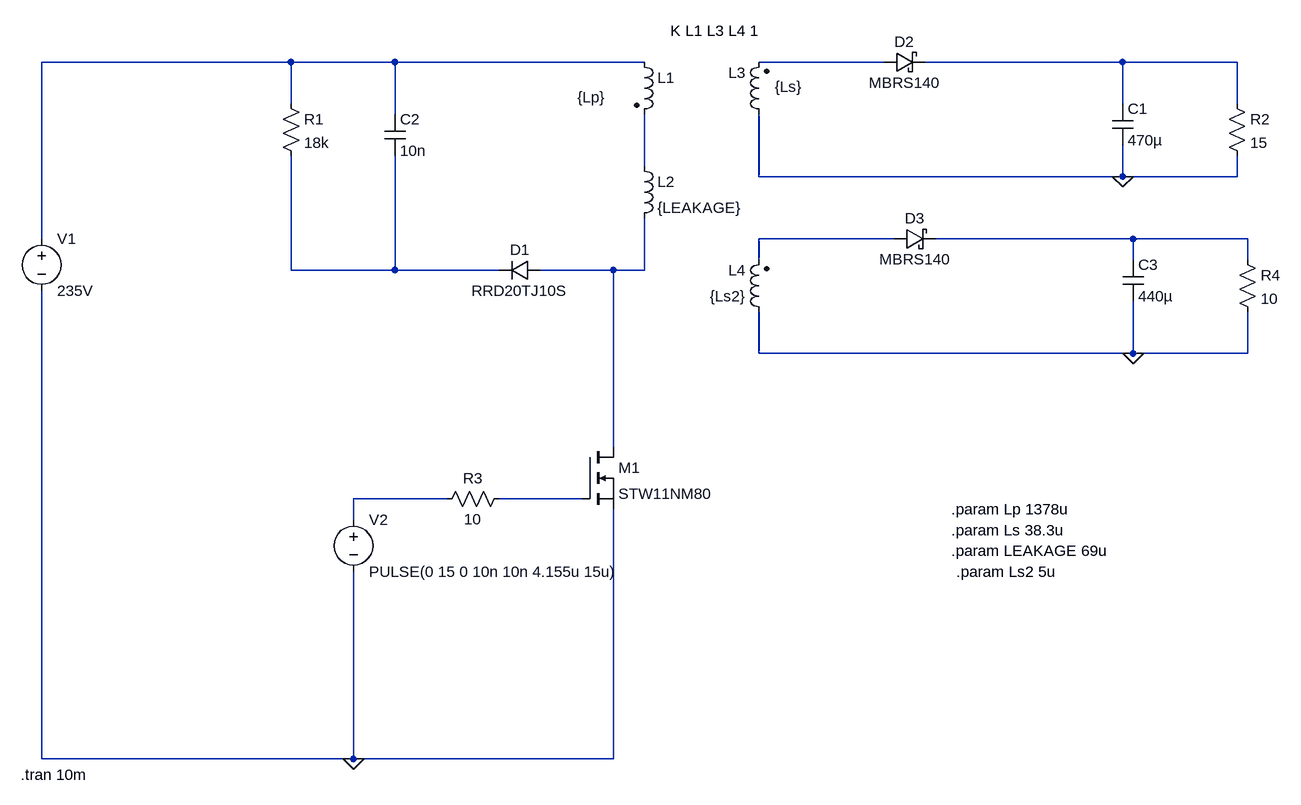
[diagram p0: schematic 98-)15V-1A 5V-0.5A 17.5W 195VAC-265VAC SMPS.asc]
98-)15V-1A 5V-0.5A 17.5W 195VAC-265VAC SMPS.asc, the LTspice schematic file:
Version 4
SHEET 1 1740 1352
WIRE 208 240 -176 240
WIRE 368 240 208 240
WIRE 752 240 368 240
WIRE 1120 240 928 240
WIRE 1488 240 1184 240
WIRE 1664 240 1488 240
WIRE 208 304 208 240
WIRE 1488 304 1488 240
WIRE 1664 304 1664 240
WIRE 368 320 368 240
WIRE 752 400 752 320
WIRE 928 416 928 320
WIRE 1488 416 1488 368
WIRE 1488 416 928 416
WIRE 1664 416 1664 384
WIRE 1664 416 1488 416
WIRE -176 512 -176 240
WIRE 1136 512 928 512
WIRE 1504 512 1200 512
WIRE 1680 512 1504 512
WIRE 928 544 928 512
WIRE 1504 544 1504 512
WIRE 1680 544 1680 512
WIRE 208 560 208 384
WIRE 368 560 368 384
WIRE 368 560 208 560
WIRE 528 560 368 560
WIRE 704 560 592 560
WIRE 752 560 752 480
WIRE 752 560 704 560
WIRE 928 688 928 624
WIRE 1504 688 1504 608
WIRE 1504 688 928 688
WIRE 1680 688 1680 624
WIRE 1680 688 1504 688
WIRE 704 832 704 560
WIRE 448 912 304 912
WIRE 656 912 528 912
WIRE 304 944 304 912
WIRE -176 1312 -176 592
WIRE 304 1312 304 1024
WIRE 304 1312 -176 1312
WIRE 704 1312 704 928
WIRE 704 1312 304 1312
FLAG 304 1312 0
FLAG 1488 416 0
FLAG 1504 688 0
SYMBOL cap 1472 304 R0
SYMATTR InstName C1
SYMATTR Value 470µ
SYMBOL diode 592 544 R90
WINDOW 0 0 32 VBottom 2
WINDOW 3 32 32 VTop 2
SYMATTR InstName D1
SYMATTR Value RRD20TJ10S
SYMBOL cap 352 320 R0
SYMATTR InstName C2
SYMATTR Value 10n
SYMBOL res 192 288 R0
SYMATTR InstName R1
SYMATTR Value 18k
SYMBOL voltage -176 496 R0
WINDOW 123 0 0 Left 0
WINDOW 39 0 0 Left 0
SYMATTR InstName V1
SYMATTR Value 235V
SYMBOL schottky 1120 256 R270
WINDOW 0 32 32 VTop 2
WINDOW 3 0 32 VBottom 2
SYMATTR InstName D2
SYMATTR Value MBRS140
SYMATTR Description Diode
SYMATTR Type diode
SYMBOL nmos 656 832 R0
SYMATTR InstName M1
SYMATTR Value STW11NM80
SYMBOL voltage 304 928 R0
WINDOW 123 0 0 Left 0
WINDOW 39 0 0 Left 0
SYMATTR InstName V2
SYMATTR Value PULSE(0 15 0 10n 10n 4.155u 15u)
SYMBOL res 1648 288 R0
SYMATTR InstName R2
SYMATTR Value 15
SYMBOL res 544 896 R90
WINDOW 0 0 56 VBottom 2
WINDOW 3 32 56 VTop 2
SYMATTR InstName R3
SYMATTR Value 10
SYMBOL ind2 736 224 R0
WINDOW 3 -87 70 Left 2
SYMATTR Value {Lp}
SYMATTR InstName L1
SYMATTR Type ind
SYMATTR SpiceLine Rser=100m
SYMBOL ind 736 384 R0
SYMATTR InstName L2
SYMATTR Value {LEAKAGE}
SYMBOL ind2 944 336 R180
WINDOW 0 36 80 Left 2
WINDOW 3 -51 58 Left 2
SYMATTR InstName L3
SYMATTR Value {Ls}
SYMATTR Type ind
SYMBOL ind2 944 640 R180
WINDOW 0 36 80 Left 2
WINDOW 3 36 40 Left 2
SYMATTR InstName L4
SYMATTR Value {Ls2}
SYMATTR Type ind
SYMBOL schottky 1136 528 R270
WINDOW 0 32 32 VTop 2
WINDOW 3 0 32 VBottom 2
SYMATTR InstName D3
SYMATTR Value MBRS140
SYMATTR Description Diode
SYMATTR Type diode
SYMBOL cap 1488 544 R0
SYMATTR InstName C3
SYMATTR Value 440µ
SYMBOL res 1664 528 R0
SYMATTR InstName R4
SYMATTR Value 10
TEXT 1224 928 Left 2 !.param Lp 1378u
TEXT 1224 960 Left 2 !.param Ls 38.3u
TEXT 1224 992 Left 2 !.param LEAKAGE 69u
TEXT 792 192 Left 2 !K L1 L3 L4 1
TEXT -208 1336 Left 2 !.tran 10m
TEXT 1232 1024 Left 2 !.param Ls2 5u

The netlist it stands for:
* 98-)15V-1A 5V-0.5A 17.5W 195VAC-265VAC SMPS.asc
C1 N003 0 470µ
D1 N008 N007 RRD20TJ10S
C2 N001 N007 10n
R1 N001 N007 18k
V1 N001 0 235V
D2 N002 N003 MBRS140
M1 N008 N010 0 0 STW11NM80
V2 N009 0 PULSE(0 15 0 10n 10n 4.155u 15u)
R2 N003 0 15
R3 N010 N009 10
L1 N001 N004 {Lp} Rser=100m
L2 N004 N008 {LEAKAGE}
L3 0 N002 {Ls}
L4 0 N005 {Ls2}
D3 N005 N006 MBRS140
C3 N006 0 440µ
R4 N006 0 10
.model D D
.lib standard.dio
.model NMOS NMOS
.model PMOS PMOS
.lib standard.mos
.param Lp 1378u
.param Ls 38.3u
.param LEAKAGE 69u
K L1 L3 L4 1
.tran 10m
.param Ls2 5u
.backanno
.end